# Altium schematic sheet POWER.SchDoc
size A3; SheetNumber: 2; SheetTotal: 6
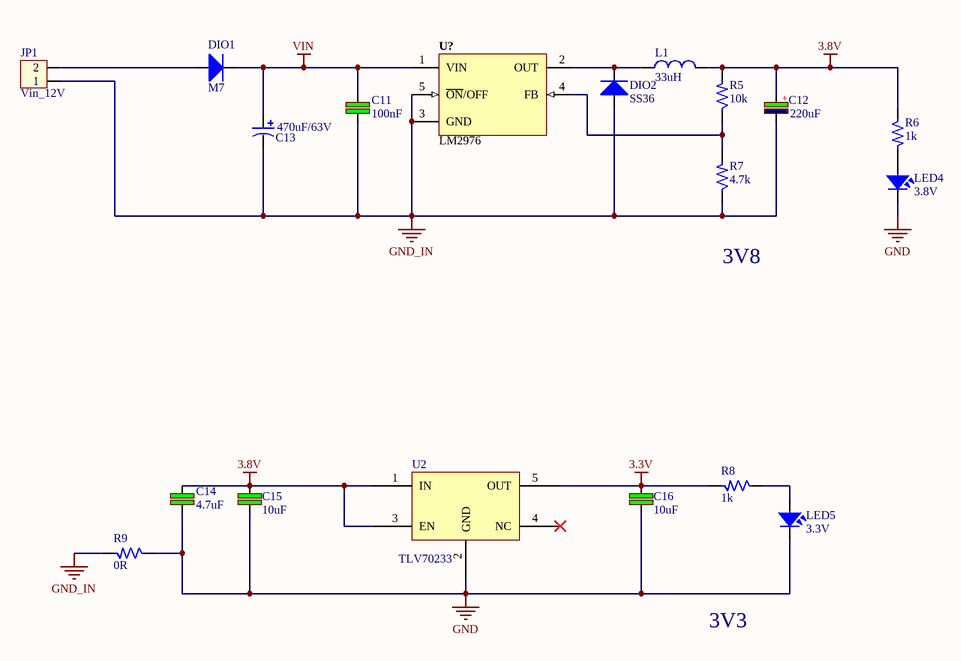
[diagram p0: POWER.SchDoc]

## Parts
C11  value 100nF  [C-0805]  (hidden comment: 4.7uF)
C12  220uF  [EEFSDE]
C13  470uF/63V  [CAP_7343]
C14  4.7uF  [C-0805]
C15  10uF  [C-0805]
C16  10uF  [C-0805]
DIO1  M7  [DIO-214AC(SMA)]
DIO2  SS36  [DIO-214AC(SMA)]
JP1  Vin_12V  [KF2-5.08]
L1  33uH  [L-SMD-M-7.3x4.5]
LED4  3.8V  [LED-0805-Blue]
LED5  3.3V  [LED-0805-Blue]
R5  10k  [R-0805]
R6  1k  [R-0805]
R7  4.7k  [R-0805]
R8  1k  [R-0805]
R9  0R  [R-0805]
U2  Name: TLV70233  [SOT23-5]  (hidden comment: TLV70223)
U?  LM2976  [TO263-5]

## Nets
3.3V: C16.1 R8.2 U2.5(OUT)
3.8V: C12.1 C14.2 C15.1 L1.2 R5.2 R6.1 U2.1(IN) U2.3(EN)
GND: C14.1 C15.2 C16.2 LED4.2 LED5.2 R9.1 U2.2(GND)
GND_IN: C11.1 C12.2 C13.2 DIO2.1(A) JP1.1 R7.1 R9.2 U?.3(GND) U?.5(~{ON}/OFF)
VIN: C11.2 C13.1 DIO1.2(K) U?.1(VIN)
NetDIO1_1: DIO1.1(A) JP1.2
NetDIO2_2: DIO2.2(K) L1.1 U?.2(OUT)
NetLED4_1: LED4.1 R6.2
NetLED5_1: LED5.1 R8.1
NetR5_1: R5.1 R7.2 U?.4(FB)

Not connected (* = marked no-connect by the designer): U2 4(NC)*

## Notes on the sheet
- 3V8
- 3V3
- (in symbol CP5) +

## Library data of the parts
C11 C14 = C: 4.7µF ±10% 35V Ceramic Capacitor X5R 0805 (2012 Metric); Manufacturer: Samsung Electro-Mechanics; Part number: CL21A475KLCLQNC; User_Description: CAP CER 4.7UF 35V X5R 0805; Category: CAPACITOR; Package: 0805
  C14: Value: 4.7uF
C12 = CP5: 220µF Molded Tantalum Polymer Capacitor 16V 2917 (7343 Metric) 40mOhm @ 100kHz; Manufacturer: AVX Corporation; Part number: TCME227M016R0040E; User_Description: CAP TANT POLY 220UF 16V 2917; Value: 220uF; Category: CAPACITOR; Package: 2917
C13 = CAP_TAN_SMD: Polazied Tantalum Capacitor
C15 C16 = C: Cap SMD; Manufacturer: Samsung Electro-Mechanics; Part number: CL21A106KPFNNNG; User_Description: CAP CER 10UF 10V X5R 0805; Value: 10uF; Category: CAPACITOR; Package: 0805
DIO1 DIO2 = Diode SMD: Default Diode; Code - JEDEC: DO-214-AB; Value: 1N5007; Published: 8-Jun-2000; Revision: July-2002: Re-released for DXP Platform.; Publisher: Altium Limited
JP1 = Con2: Connector 2; Value: Connector 2
L1 = Inductor: https://linhkien.cxt.vn/6932-cuon-cam-cd74-cac-gia-tri.html; Value: 150 mH
LED4 LED5 = LED: LED Single colour Green and Red; Value: LED 3 ly Single Colour
R5 = R: RES SMD 10K OHM 1% 1/8W 0805; Manufacturer: Yageo; Part number: RC0805FR-0710KL; Category: RESISTORS; Package: 0805; User_Description: RES SMD 10K OHM 1% 1/8W 0805; Value: 10k
R6 R8 = R: Resistor 1/4W; Manufacturer: Yageo; Part number: RC0805FR-071KL; User_Description: RES SMD 1K OHM 1% 1/8W 0805; Value: 1k; Category: RESISTORS; Package: 0805
R7 = R: RES SMD 3.3K OHM 1% 1/8W 0805; Manufacturer: Yageo; Part number: RC0805FR-073K3L; Category: RESISTORS; Package: 0805; User_Description: RES SMD 3.3K OHM 1% 1/8W 0805; Value: 3.3k
R9 = R: Resistor 1/4W; Manufacturer: Yageo; Part number: RC0805FR-071KL; Value: 1k; User_Description: RES SMD 1K OHM 1% 1/8W 0805; Category: RESISTORS; Package: 0805
U2 = TLV70223: IC æn ¸p TLV70233, d¸n; Package: SOT23-5
U? = LM2596: Max Input Voltage: 12 V; Max Output Current: 3 (6.0 peak) A; Max Output Voltage: mV; Category: IC-Power; Min Input Voltage: mV; Min Output Voltage: mV; Mounting Technology: Surface Mount; Status: Unreleased; Supply Voltage: mV; Temperature Range: -40 to +125 degC